# Altium schematic sheet 20.SchDoc
size 431 x 322 mm
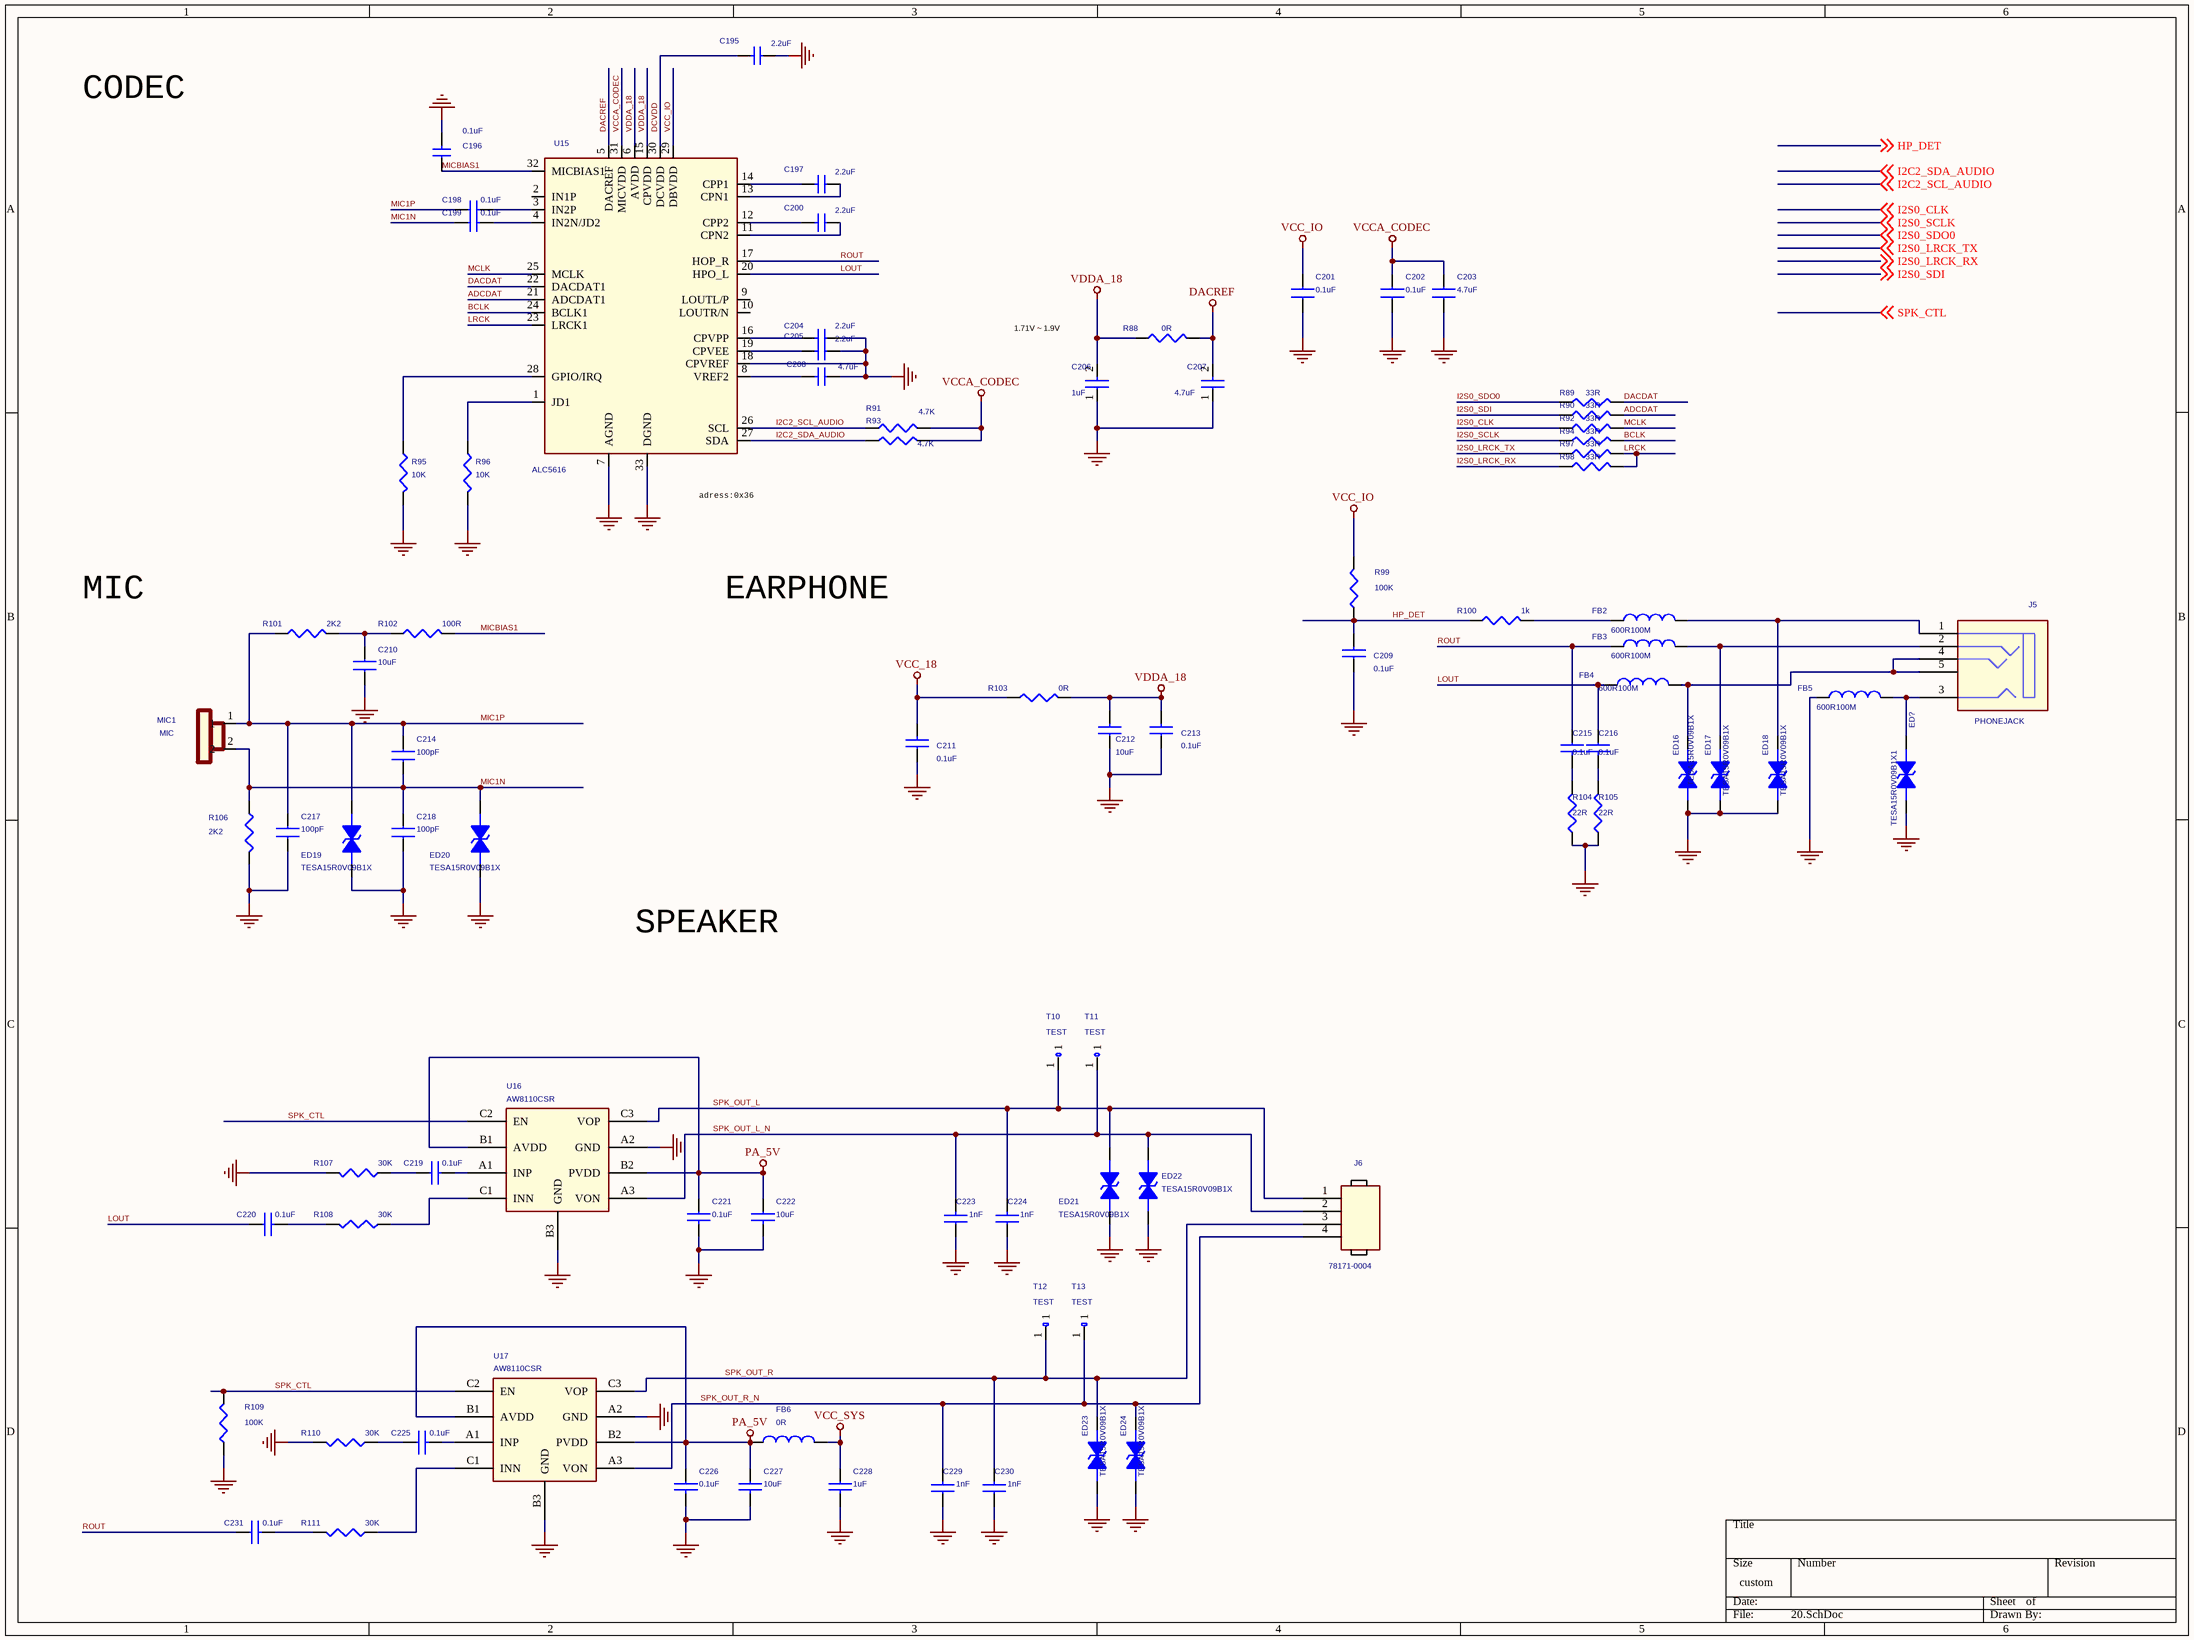
[diagram p0: 20.SchDoc]

## Parts
C195  2.2uF  [C0603]
C196  0.1uF  [c0402]
C197  2.2uF  [C0603]
C198  0.1uF  [c0402]
C199  0.1uF  [c0402]
C200  2.2uF  [C0603]
C201  0.1uF  [C0603]
C202  0.1uF  [C0603]
C203  4.7uF  [C0603]
C204  2.2uF  [C0603]
C205  2.2uF  [C0603]
C206  1uF  [c0402]
C207  4.7uF  [C0603]
C208  4.7uF  [C0603]
C209  0.1uF  [c0402]
C210  10uF  [C0603]
C211  0.1uF  [C0201]
C212  10uF  [C0603]
C213  0.1uF  [c0402]
C214  100pF  [C0603]
C215  0.1uF  [c0402]
C216  0.1uF  [c0402]
C217  100pF  [C0603]
C218  100pF  [C0603]
C219  0.1uF  [C0402]
C220  0.1uF  [C0402]
C221  0.1uF  [C0402]
C222  10uF  [C0402]
C223  1nF  [C0402]
C224  1nF  [C0402]
C225  0.1uF  [C0402]
C226  0.1uF  [C0402]
C227  10uF  [C0402]
C228  1uF  [C0402]
C229  1nF  [C0402]
C230  1nF  [C0402]
C231  0.1uF  [C0402]
ED16  TESA15R0V09B1X  [E0402N]
ED17  TESA15R0V09B1X  [E0402N]
ED18  TESA15R0V09B1X  [E0402N]
ED19  TESA15R0V09B1X  [E0201]
ED20  TESA15R0V09B1X  [E0201]
ED21  TESA15R0V09B1X  [E0201]
ED22  TESA15R0V09B1X  [E0201]
ED23  TESA15R0V09B1X  [E0402N]
ED24  TESA15R0V09B1X  [E0402N]
FB2  600R100M  [L0402]
FB3  600R100M  [L0402]
FB4  600R100M  [L0402]
FB5  600R100M  [L0402]
FB6  0R  [L0603]
J5  PHONEJACK  [J301R05GA6ZL2]
J6  78171-0004  [78171-0004]
MIC1  MIC  [78171-0002]
R88  0R  [R0402]
R89  33R  [r0402]
R90  33R  [r0402]
R91  4.7K  [r0402]
R92  33R  [r0402]
R93  4.7K  [r0402]
R94  33R  [r0402]
R95  10K  [r0402]
R96  10K  [r0402]
R97  33R  [r0402]
R98  33R  [r0402]
R99  100K  [r0402]
R100  1k  [r0402]
R101  2K2  [r0402]
R102  100R  [r0402]
R103  0R  [R0402]
R104  22R  [r0402]
R105  22R  [r0402]
R106  2K2  [r0402]
R107  30K  [R0402]
R108  30K  [R0402]
R109  100K  [r0402]
R110  30K  [R0402]
R111  30K  [R0402]
T10  TEST  [TEST]
T11  TEST  [TEST]
T12  TEST  [TEST]
T13  TEST  [TEST]
TESA15R0V09B1X1  ED?  [E0402N]
U15  ALC5616  [QFN32]
U16  AW8110CSR  [CSP9]
U17  AW8110CSR  [CSP9]

## Nets
DACREF: C207.2 R88.2 U15.5(DACREF)
GND: C195.1 C196.2 C201.1 C202.1 C203.1 C204.1 C205.1 C206.1 C207.1 C208.1 C209.1 C210.1 C211.1 C212.1 C213.1 C217.1 C218.1 C221.2 C222.2 C223.1 C224.1 C226.2 C227.2 C228.2 C229.1 C230.1 ED16.2 ED17.2 ED18.2 ED19.2 ED20.2 ED21.2 ED22.2 ED23.2 ED24.2 FB5.2 R95.1 R96.1 R104.1 R105.1 R106.1 R107.2 R109.2 R110.2 TESA15R0V09B1X1.2 U15.7(AGND) U15.18(CPVREF) U15.33(DGND) U16.A2(GND) U16.B3(GND) U17.A2(GND) U17.B3(GND)
PA_5V: C221.1 C222.1 C226.1 C227.1 FB6.2 U16.B1(AVDD) U16.B2(PVDD) U17.B1(AVDD) U17.B2(PVDD)
VCC_18: C211.2 R103.1
VCC_IO: C201.2 R99.1 U15.29(DBVDD)
VCC_SYS: C228.1 FB6.1
VCCA_CODEC: C202.2 C203.2 R91.2 R93.2 U15.31(MICVDD)
VDDA_18: C206.2 C212.2 C213.2 R88.1 R103.2 U15.6(AVDD) U15.15(CPVDD)
ADCDAT: R90.2 U15.21(ADCDAT1)
BCLK: R94.2 U15.24(BCLK1)
DACDAT: R89.2 U15.22(DACDAT1)
DCVDD: C195.2 U15.30(DCVDD)
HP_DET: C209.2 R99.2 R100.2 ; off-sheet HP_DET
I2C2_SCL_AUDIO: R91.1 U15.26(SCL) ; off-sheet I2C2_SCL_AUDIO
I2C2_SDA_AUDIO: R93.1 U15.27(SDA) ; off-sheet I2C2_SDA_AUDIO
I2S0_CLK: R92.1 ; off-sheet I2S0_CLK
I2S0_LRCK_RX: R98.1 ; off-sheet I2S0_LRCK_RX
I2S0_LRCK_TX: R97.1 ; off-sheet I2S0_LRCK_TX
I2S0_SCLK: R94.1 ; off-sheet I2S0_SCLK
I2S0_SDI: R90.1 ; off-sheet I2S0_SDI
I2S0_SDO0: R89.1 ; off-sheet I2S0_SDO0
LOUT: C216.1 C220.1 FB4.2 U15.20(HPO_L)
LRCK: R97.2 R98.2 U15.23(LRCK1)
MCLK: R92.2 U15.25(MCLK)
MIC1N: C199.1 C214.1 C218.2 ED20.1 MIC1.2 R106.2
MIC1P: C198.1 C214.2 C217.2 ED19.1 MIC1.1 R101.1
MICBIAS1: C196.1 R102.1 U15.32(MICBIAS1)
ROUT: C215.1 C231.1 FB3.2 U15.17(HOP_R)
SPK_CTL: R109.1 U16.C2(EN) U17.C2(EN) ; off-sheet SPK_CTL
SPK_OUT_L: C224.2 ED21.1 J6.1 T10.1 U16.C3(VOP)
SPK_OUT_L_N: C223.2 ED22.1 J6.2 T11.1 U16.A3(VON)
SPK_OUT_R: C230.2 ED23.1 J6.3 T12.1 U17.C3(VOP)
SPK_OUT_R_N: C229.2 ED24.1 J6.4 T13.1 U17.A3(VON)
NetC197_1: C197.1 U15.13(CPN1)
NetC197_2: C197.2 U15.14(CPP1)
NetC198_2: C198.2 U15.3(IN2P)
NetC199_2: C199.2 U15.4(IN2N/JD2)
NetC200_1: C200.1 U15.11(CPN2)
NetC200_2: C200.2 U15.12(CPP2)
NetC204_2: C204.2 U15.16(CPVPP)
NetC205_2: C205.2 U15.19(CPVEE)
NetC208_2: C208.2 U15.8(VREF2)
NetC210_2: C210.2 R101.2 R102.2
NetC215_2: C215.2 R104.2
NetC216_2: C216.2 R105.2
NetC219_1: C219.1 R107.1
NetC219_2: C219.2 U16.A1(INP)
NetC220_2: C220.2 R108.2
NetC225_1: C225.1 R110.1
NetC225_2: C225.2 U17.A1(INP)
NetC231_2: C231.2 R111.2
NetED16_1: ED16.1 FB4.1 J5.4(R) J5.5(L)
NetED17_1: ED17.1 FB3.1 J5.2(D)
NetED18_1: ED18.1 FB2.1 J5.1(HP)
NetFB2_2: FB2.2 R100.1
NetFB5_1: FB5.1 J5.3(R1) TESA15R0V09B1X1.1
NetR95_2: R95.2 U15.28(GPIO/IRQ)
NetR96_2: R96.2 U15.1(JD1)
NetR108_1: R108.1 U16.C1(INN)
NetR111_1: R111.1 U17.C1(INN)

Not connected (* = marked no-connect by the designer): U15 2(IN1P) 9(LOUTL/P) 10(LOUTR/N)

## Notes on the sheet
- CODEC
- 1.71V ~ 1.9V
- (near U15) adress:0x36
- MIC
- EARPHONE
- SPEAKER

## Library data of the parts
C195 C197 C200 C204 C205 = SMALL CAP: RoHS CHIP CAP 2.2uF +10/-10% X5R
C196 C198 C199 = SMALL CAP: RoHS CHIP CAP 0.1uF +10/-10% X7R
C201 C202 = CAP NP_Dup3: RoHS CHIP CAP 0.1uF +10/-10% X7R
C203 = CAP NP_Dup3: RoHS CHIP CAP 2.2uF +10/-10% X5R
C206 C207 = CAP NP_0: RoHS CHIP CAP 4.7uF +10/-10% X5R
C208 = SMALL CAP: RoHS CHIP CAP 4.7uF +10/-10% X5R
C209 C211-C213 = CAP NP_4
C210 = CAP NP_Dup3
C214 C217 C218 = CAP NP_Dup3: RoHS CHIP CAP 100pF +10/-10% X7R
C215 C216 = CAP NP_Dup1: RoHS CHIP CAP 0.1uF +10/-10% X7R
C219-C221 C225 C226 C231 = CAP NP_Dup2: RoHS CHIP CAP 0.1uF +10/-10% X7R
C222 C227 C228 = CAP NP_Dup2: RoHS CHIP CAP 10uF +10/-10% X5R; ROOM: USB+5V; MARK: 106
C223 C224 C229 C230 = CAP NP_Dup2: RoHS CHIP CAP 1nF +10/-10% X7R
ED16-ED18 ED23 ED24 TESA15R0V09B1X1 = TVS: ESD Component,5V,30P,SMD,0402
ED19-ED22 = DIODE BI-DIR TRIG: NC/ESD Component,5V,30P,SMD,0402
FB2-FB5 = INDUCTOR_Dup1: ROHS CHIP RES 33R 1/16W 5%; Supplier: MURATA; Supplier P/N: BLM18PG181SN1D
FB6 = INDUCTOR_Dup1: ROHS CHIP RES 0 Ohm 1/16W +/-5%; Supplier P/N: BLM18PG181SN1D; Supplier: MURATA
J5 = PHONEJACK STEREO SW_0: 耳插
J6 = HEADER 4
R88 R91 R93 = R: ROHS CHIP RES 0 Ohm 1/16W +/-5%
R89 R90 R92 R94 R97 R98 = R: ROHS CHIP RES 33 Ohm 1/16W +/-5%
R95 R96 = RESISTOR: ROHS CHIP RES 10K 1/16W +/-5%
R99 R100 R102 R109 = RESISTOR_1_Dup2: RES,thick film,10KOhm,+/-5%,1/16W,SMD0402
R101 = RESISTOR_0_Dup2
R103 = RESISTOR: ROHS CHIP RES 0R 1/16W 5%
R104 R105 = RESISTOR: ROHS CHIP RES 22R 1/16W 5%
R106 = RESISTOR_0_Dup2: 贴片电阻
R107 R108 R110 R111 = RESISTOR_Dup1: ROHS CHIP RES 30K 1/16W +/-5%
T10-T13 = TEST_0
U15 = ALC5616: CODEC IC
U16 U17 = LM4990_0: Class D Audio AMP